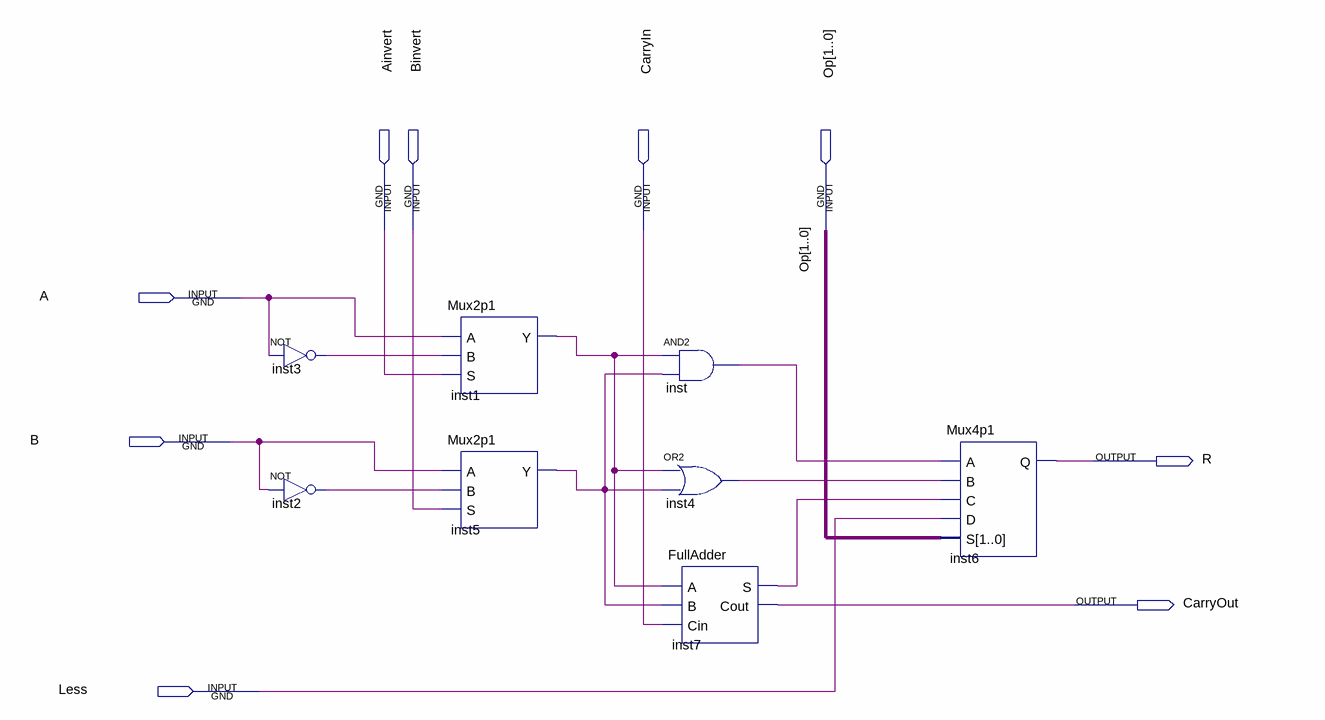
[diagram p0: schematic sheet]
// Quartus schematic ULA.bdf as structural Verilog: 8 symbols, 9 pins
module ULA (
  input  Ainvert,
  input  Binvert,
  input  CarryIn,
  input  [1:0] Op,
  input  A,
  input  B,
  input  Less,
  output R,
  output CarryOut
);

  wire inst1_y, inst2_out, inst3_out, inst4_out, inst5_y, inst7_s, inst_out;

  not inst3 (inst3_out, A);
  not inst2 (inst2_out, B);
  Mux2p1 inst1 (.A(A), .B(inst3_out), .S(Ainvert), .Y(inst1_y));
  Mux2p1 inst5 (.A(B), .B(inst2_out), .S(Binvert), .Y(inst5_y));
  and inst (inst_out, inst1_y, inst5_y);
  or inst4 (inst4_out, inst1_y, inst5_y);
  FullAdder inst7 (.A(inst1_y), .B(inst5_y), .Cin(CarryIn), .S(inst7_s), .Cout(CarryOut));
  Mux4p1 inst6 (.A(inst_out), .B(inst4_out), .C(inst7_s), .D(Less), .S(Op), .Q(R));
endmodule
